# EAGLE design AudioMega 1206 v1 (EAGLE 6.3)
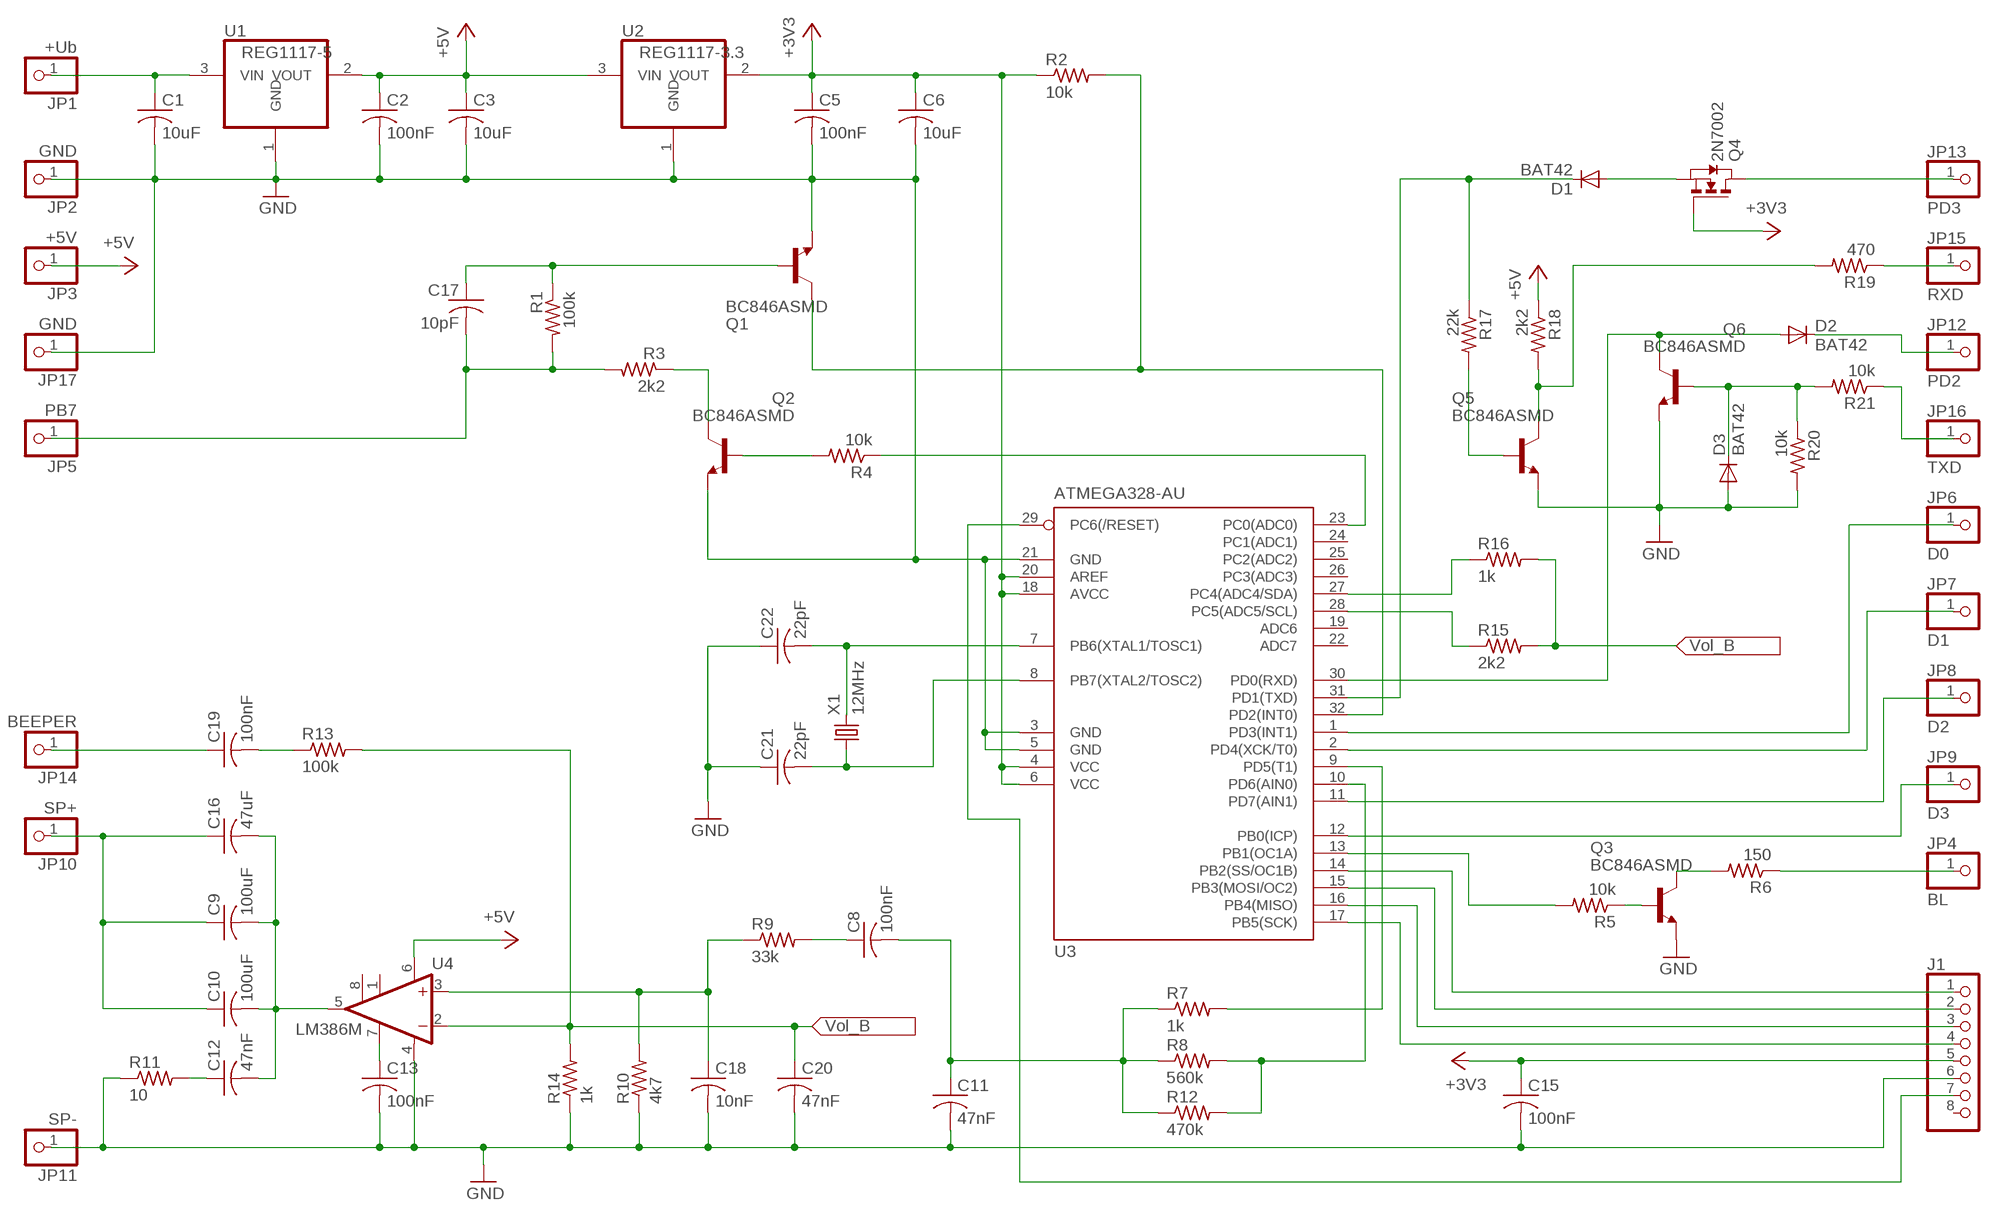
[diagram p0: schematic, sheet 1]

## Parts
C1  10uF  C-USC1206  [C1206]
C2  100nF  C-USC1206  [C1206]
C3  10uF  C-USC1206  [C1206]
C5  100nF  C-USC1206  [C1206]
C6  10uF  C-USC1206  [C1206]
C8  100nF  C-USC1206  [C1206]
C9  100uF  C-USC1206  [C1206]
C10  100uF  C-USC1206  [C1206]
C11  47nF  C-USC1206  [C1206]
C12  47nF  C-USC1206  [C1206]
C13  100nF  C-USC1206  [C1206]
C15  100nF  C-USC1206  [C1206]
C16  47uF  C-USC1206  [C1206]
C17  10pF  C-USC1206  [C1206]
C18  10nF  C-USC1206  [C1206]
C19  100nF  C-USC1206  [C1206]
C20  47nF  C-USC1206  [C1206]
C21  22pF  C-USC1206  [C1206]
C22  22pF  C-USC1206  [C1206]
D1  BAT42  DIODE-SOD123  [SOD123]
D2  BAT42  DIODE-SOD123  [SOD123]
D3  BAT42  DIODE-SOD123  [SOD123]
J1  PINHD-1X8  [1X08]
JP1  +Ub  PINHD-1X1  [1X01]
JP2  GND  PINHD-1X1  [1X01]
JP3  +5V  PINHD-1X1  [1X01]
JP4  BL  PINHD-1X1  [1X01]
JP5  PB7  PINHD-1X1  [1X01]
JP6  D0  PINHD-1X1  [1X01]
JP7  D1  PINHD-1X1  [1X01]
JP8  D2  PINHD-1X1  [1X01]
JP9  D3  PINHD-1X1  [1X01]
JP10  SP+  PINHD-1X1  [1X01]
JP11  SP-  PINHD-1X1  [1X01]
JP12  PD2  PINHD-1X1  [1X01]
JP13  PD3  PINHD-1X1  [1X01]
JP14  BEEPER  PINHD-1X1  [1X01]
JP15  RXD  PINHD-1X1  [1X01]
JP16  TXD  PINHD-1X1  [1X01]
JP17  GND  PINHD-1X1  [1X01]
Q1  BC846ASMD  [SOT23]
Q2  BC846ASMD  [SOT23]
Q3  BC846ASMD  [SOT23]
Q4  2N7002  NMOSSOT23  [SOT-23]
Q5  BC846ASMD  [SOT23]
Q6  BC846ASMD  [SOT23]
R1  100k  R-US_R1206  [R1206]
R2  10k  R-US_R1206  [R1206]
R3  2k2  R-US_R1206  [R1206]
R4  10k  R-US_R1206  [R1206]
R5  10k  R-US_R1206  [R1206]
R6  150  R-US_R1206  [R1206]
R7  1k  R-US_R1206  [R1206]
R8  560k  R-US_R1206  [R1206]
R9  33k  R-US_R1206  [R1206]
R10  4k7  R-US_R1206  [R1206]
R11  10  R-US_R1206  [R1206]
R12  470k  R-US_R1206  [R1206]
R13  100k  R-US_R1206  [R1206]
R14  1k  R-US_R1206  [R1206]
R15  2k2  R-US_R1206  [R1206]
R16  1k  R-US_R1206  [R1206]
R17  22k  R-US_R1206  [R1206]
R18  2k2  R-US_R1206  [R1206]
R19  470  R-US_R1206  [R1206]
R20  10k  R-US_R1206  [R1206]
R21  10k  R-US_R1206  [R1206]
U1  REG1117-5  REG1117  [SOT223]
U2  REG1117-3.3  REG1117  [SOT223]
U3  ATMEGA328-AU  MEGA8-AI  [TQFP32-08]
U4  LM386M  LM386M-1  [SO08]
X1  12MHz  CRYSTALHC49UP  [HC49UP]

## Nets
+3V3: C5.1 C6.1 C15.1 J1.5 Q4.3(G) R2.1 U2.2(VOUT) U3.4(VCC) U3.6(VCC) U3.18(AVCC) U3.20(AREF)
+5V: C2.1 C3.1 JP3.1 R18.1 U1.2(VOUT) U2.3(VIN) U4.6(VS)
B7: C17.2 JP5.1 R1.2 R3.2
CLK: Q1.3(C) R2.2 U3.32(PD2(INT0))
GND: C1.2 C2.2 C3.2 C5.2 C6.2 C11.2 C13.2 C15.2 C18.2 C20.2 C21.1 C22.1 D3.A J1.6 JP2.1 JP11.1 JP17.1 Q1.2(E) Q2.2(E) Q3.2(E) Q5.2(E) Q6.2(E) R10.1 R11.1 R14.1 R20.2 U1.1(GND) U2.1(GND) U3.3(GND) U3.5(GND) U3.21(GND) U4.4(GND)
N$1: R4.1 U3.23(PC0(ADC0))
N$2: J1.1 U3.14(PB2(SS/OC1B))
N$3: J1.2 U3.15(PB3(MOSI/OC2))
N$4: J1.3 U3.16(PB4(MISO))
N$5: J1.4 U3.17(PB5(SCK))
N$6: J1.7 U3.29(PC6(/RESET))
N$7: C22.2 U3.7(PB6(XTAL1/TOSC1)) X1.2
N$8: C21.2 U3.8(PB7(XTAL2/TOSC2)) X1.1
N$9: Q2.1(B) R4.2
N$10: R16.1 U3.27(PC4(ADC4/SDA))
N$11: R15.1 U3.28(PC5(ADC5/SCL))
N$12: Q2.3(C) R3.1
N$13: C17.1 Q1.1(B) R1.1
N$14: C13.1 U4.7(BYPASS)
N$15: C9.1 C10.1 C16.1 JP10.1
N$16: C12.1 R11.2
N$17: C9.2 C10.2 C12.2 C16.2 U4.5(OUT)
N$18: C18.1 R9.1 R10.2 U4.3(+IN)
N$19: C19.1 JP14.1
N$20: C19.2 R13.1
N$24: C8.1 R9.2
N$25: C8.2 C11.1 R7.1 R8.1 R12.1
N$26: Q3.3(C) R6.2
N$27: R7.2 U3.9(PD5(T1))
N$28: R8.2 R12.2 U3.10(PD6(AIN0))
N$29: JP4.1 R6.1
N$30: JP9.1 U3.12(PB0(ICP))
N$31: JP8.1 U3.11(PD7(AIN1))
N$32: C1.1 JP1.1 U1.3(VIN)
N$33: Q3.1(B) R5.1
N$34: R5.2 U3.13(PB1(OC1A))
N$35: JP7.1 U3.2(PD4(XCK/T0))
N$36: JP6.1 U3.1(PD3(INT1))
N$37: JP16.1 R21.1
N$38: JP15.1 R19.1
N$39: D2.C JP12.1
N$40: D3.C Q6.1(B) R20.1 R21.2
N$41: JP13.1 Q4.1(D)
N$42: D2.A Q6.3(C) U3.30(PD0(RXD))
N$43: Q5.3(C) R18.2 R19.2
N$44: Q5.1(B) R17.2
N$45: D1.A Q4.2(S)
N$46: D1.C R17.1 U3.31(PD1(TXD))
VOL_B: C20.1 R13.2 R14.2 R15.2 R16.2 U4.2(-IN)
Unconnected: J1.8 U3.19(ADC6) U3.22(ADC7) U3.24(PC1(ADC1)) U3.25(PC2(ADC2)) U3.26(PC3(ADC3)) U4.1(GAIN) U4.8(GAIN)

## Library data of the parts
C1-C3 C5 C6 C8-C13 C15-C22 = resistor:C-US: CAPACITOR, American symbol
D1-D3 = diode:DIODE-: DIODE
J1 = pinhead:PINHD-1X8: PIN HEADER
JP1-JP17 = pinhead:PINHD-1X1: PIN HEADER
Q1-Q3 Q5 Q6 = transistor-npn:BC846*: NPN Transistor
Q4 = zetex:NMOSSOT23: MOS FET; OC_FARNELL: unknown; OC_NEWARK: unknown
R1-R21 = resistor:R-US_: RESISTOR, American symbol
U1 U2 = burr-brown:REG1117: 800mA and 1A Low Dropout (LDO) Positive Regulator 1.8V, 2.5V, 2.85V, 3.3V, 5V, and Adj; MPN: REG1117; OC_FARNELL: 1097566; OC_NEWARK: 14P6981
U3 = atmel:MEGA8: MICROCONTROLLER 8 Kbytes FLASH, 1 kbytes SRAM, 512 bytes EEPROM, USART, 6-channel 10 bit ADC, 2-channel 8 bit ADC Pin compatible with Atmega48, ATMega88, ATMega168 Source: avr.lbr; MPN: ATMEGA8-16AU; OC_FARNELL: 9171371; OC_NEWARK: 73M8863
U4 = linear:LM386?-*: Low Voltage Audio Power Amplifier Source: http://cache.national.com/ds/LM/LM386.pdf
X1 = crystal:CRYSTAL: CRYSTAL; OC_FARNELL: unknown; OC_NEWARK: unknown

## Board
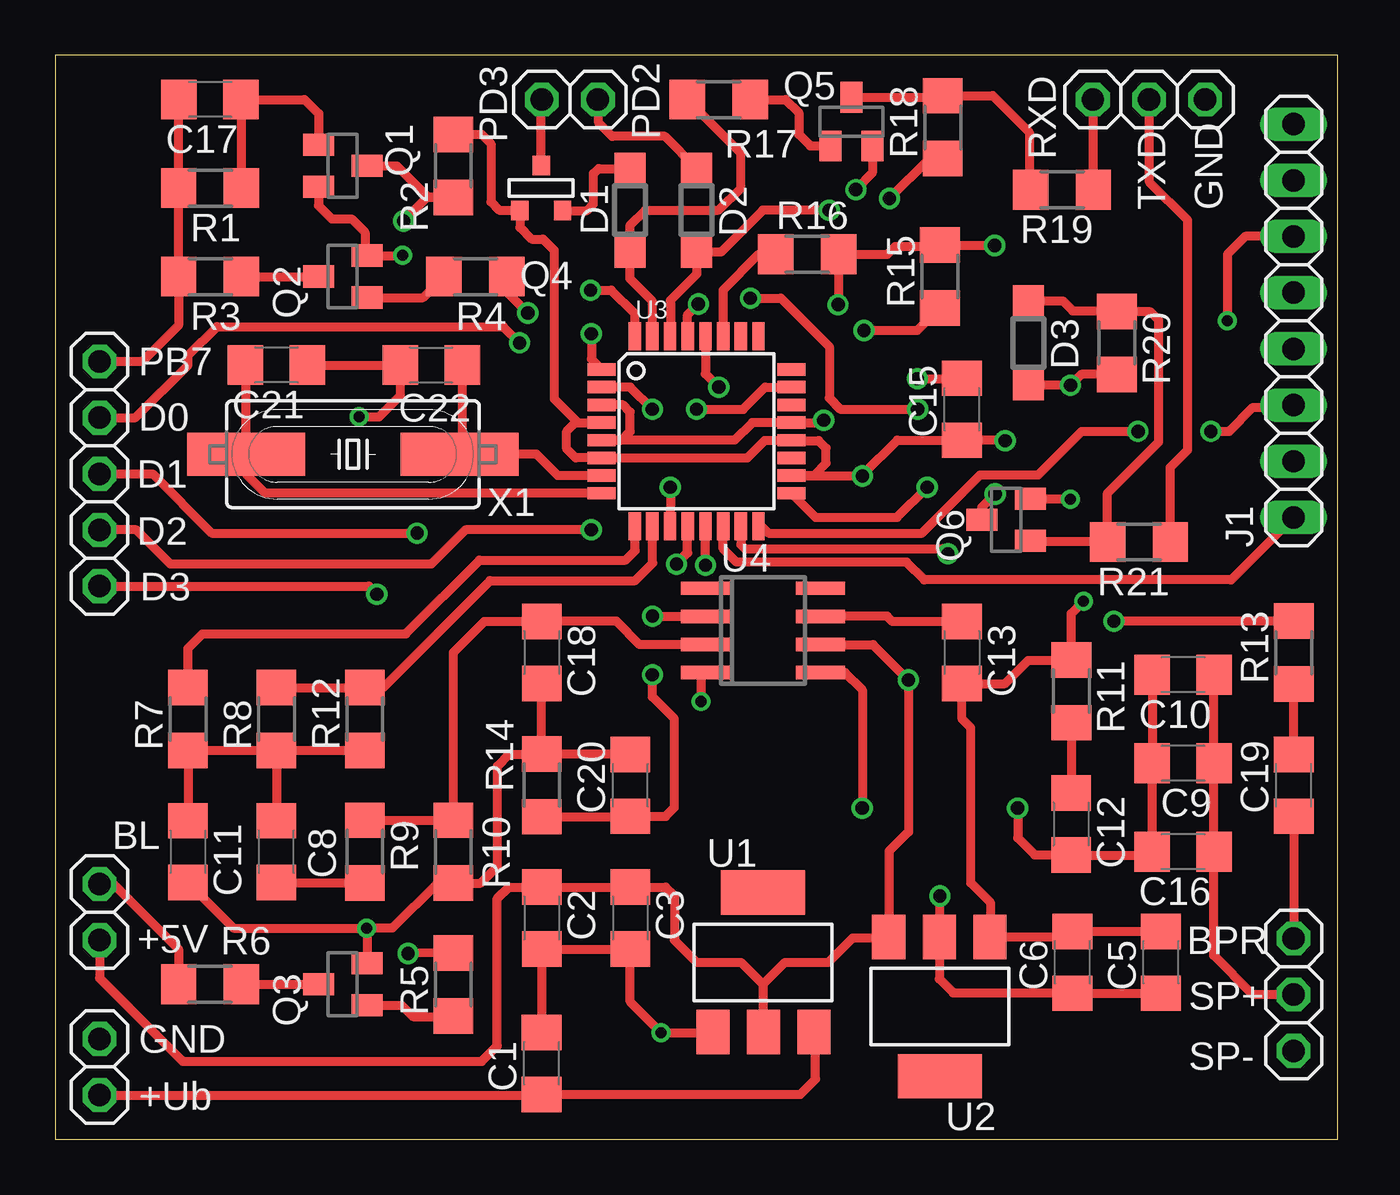
[diagram p1: board, top side]
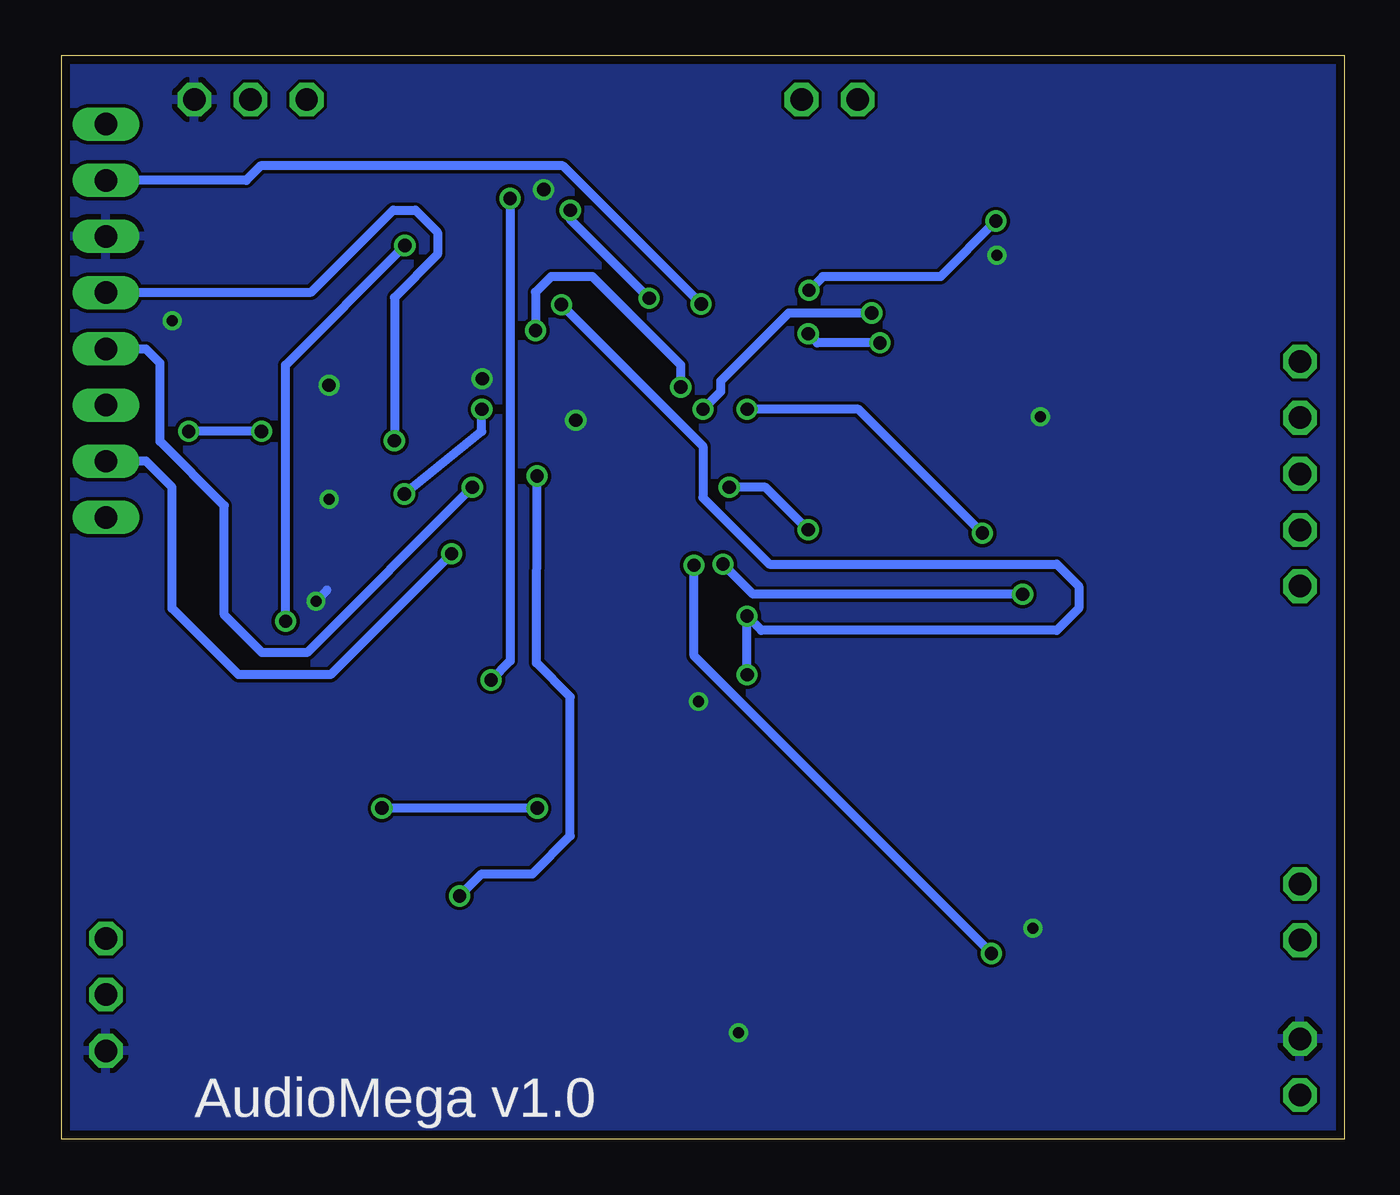
[diagram p2: board, bottom side, seen from below]

Size 58 x 49 mm. Coordinates in mm from the lower left corner, seen from the top.
Outline: 0,0 58,0 58,49 0,49 0,0
Copper layers (1*16): Top 0.0356mm / dielectric 1.5011mm / Bottom 0.0356mm
Design rules "LaenPCBOrder *": minimum track width 6mil, minimum drill 13mil, track to track 6mil, track to pad 6mil, pad to pad 6mil, via to via 6mil, smd to smd 6mil, copper to edge 15mil, drill to drill 6mil, minimum pad ring 7mil, minimum via ring 7mil, stop-mask expansion 4mil, vias tented up to drill 24mil, thermal gap 10mil

### Footprints (pad centres in the part's own frame; a part is rotated, then mirrored left to right if it is on the bottom)
C1206 = smd 1.6 x 1.8: 1 -1.4,0; 2 1.4,0
SOD123 = smd 1.4 x 1.4: A 1.9,0; C -1.9,0
1X08 = drill 1.016 long: 1 -8.89,0; 2 -6.35,0; 3 -3.81,0; 4 -1.27,0; 5 1.27,0; 6 3.81,0; 7 6.35,0; 8 8.89,0
1X01 = drill 1.016 octagon: 1 0,0
SOT23 = smd 1 x 1.4: 1 -0.95,-1.1; 2 0.95,-1.1; 3 0,1.1
SOT-23 = smd 0.787 x 0.889: 1 0.025,-1.016; 2 -0.94,1.016; 3 0.991,1.016
R1206 = smd 1.6 x 1.803: 1 -1.422,0; 2 1.422,0
SOT223 = smd 1.499 x 2.007: 1 -2.261,-3.15; 2 0.025,-3.15; 3 2.311,-3.15 | smd 3.81 x 2.007: 4 0,3.15
TQFP32-08 = smd 1.27 x 0.559: 1 -4.293,2.8; 2 -4.293,2; 3 -4.293,1.2; 4 -4.293,0.4; 5 -4.293,-0.4; 6 -4.293,-1.2; 7 -4.293,-2; 8 -4.293,-2.8; 17 4.293,-2.8; 18 4.293,-2; 19 4.293,-1.2; 20 4.293,-0.4; 21 4.293,0.4; 22 4.293,1.2; 23 4.293,2; 24 4.293,2.8 | smd 0.559 x 1.27: 9 -2.8,-4.293; 10 -2,-4.293; 11 -1.2,-4.293; 12 -0.4,-4.293; 13 0.4,-4.293; 14 1.2,-4.293; 15 2,-4.293; 16 2.8,-4.293; 25 2.8,4.293; 26 2,4.293; 27 1.2,4.293; 28 0.4,4.293; 29 -0.4,4.293; 30 -1.2,4.293; 31 -2,4.293; 32 -2.8,4.293
SO08 = smd 0.6 x 2.2: 1 -1.905,-2.6; 2 -0.635,-2.6; 3 0.635,-2.6; 4 1.905,-2.6; 5 1.905,2.6; 6 0.635,2.6; 7 -0.635,2.6; 8 -1.905,2.6
HC49UP = smd 5.334 x 1.93: 1 -4.826,0; 2 4.826,0

### Placement (x,y rotation side)
C1  21.99,3.43 90 top
C2  22,10 270 top
C3  26,10 270 top
C5  50,8 90 top
C6  46,8 90 top
C8  10,13 90 top
C9  51,17 180 top
C10  51,21 180 top
C11  6,13 270 top
C12  45.94,14.25 270 top
C13  41,22 270 top
C15  41,33 90 top
C16  51,13 180 top
C17  7,47 180 top
C18  22,22 270 top
C19  56,16 90 top
C20  26,16 90 top
C21  10,35 180 top
C22  17,35 0 top
D1  26,42 90 top
D2  29,42 270 top
D3  44,36 270 top
J1  56,37 90 top
JP1  2,2 0 top
JP2  2,4.54 0 top
JP3  2,9 0 top
JP4  2,11.54 0 top
JP5  2,35.16 0 top
JP6  2,32.62 0 top
JP7  2,30.08 0 top
JP8  2,27.54 0 top
JP9  2,25 0 top
JP10  56,6.54 0 top
JP11  56,4 0 top
JP12  24.54,47 0 top
JP13  22,47 0 top
JP14  56,9.08 0 top
JP15  46.92,47 0 top
JP16  49.46,47 0 top
JP17  52,47 0 top
Q1  13,44 270 top
Q2  13,39 90 top
Q3  13,7 90 top
Q4  22,43 180 top
Q5  36,46 0 top
Q6  43,28 90 top
R1  7,43 180 top
R2  18,44 270 top
R3  7,39 180 top
R4  19,39 180 top
R5  18,7 90 top
R6  7,7 0 top
R7  6,19 90 top
R8  10,19 90 top
R9  14,13 270 top
R10  18,13 90 top
R11  45.94,20.25 270 top
R12  14,19 90 top
R13  56,22 90 top
R14  22,16 270 top
R15  40,39 90 top
R16  34,40 0 top
R17  30,47 0 top
R18  40.13,45.75 90 top
R19  45.52,42.93 180 top
R20  48,36 270 top
R21  49,27 180 top
U1  32,8 0 top
U2  40,6 180 top
U3  29,32 0 top
U4  32,23 270 top
X1  13.46,30.97 0 top

### Tracks (layer width: path | path; a pad name or v marks a point on that pad's centre or on a via)
+3V3  (via drill 0.6)
  Top 0.406: C5.1 C6.1 45.98,6.62 40.61,6.62 39.98,7.25 U2.2 40,9.18 v40,11 | 23.65,32.38 23.5,32.38 23.12,32 23.12,31.21 23.53,30.8 U3.6 31.3,30.8 32.08,31.58 33.27,31.58 | 23.65,32.38 24.69,32.38 U3.4 | 33.27,31.58 U3.20 | R2.1 19.28,45.42 19.7,45 19.7,42.37 20.07,42 20.99,42 Q4.3 21.01,41.22 21.54,40.69 22.05,40.69 22.56,40.18 22.56,33.47 23.65,32.38 | v42.95,31.58 42.93,31.6 C15.1 38.08,31.61 36.53,30.06 v36.5,29.98 33.31,29.98 U3.18 33.31,30.02 34.32,30.02 34.86,30.56 34.86,31.24 34.52,31.58 33.27,31.58
  Bottom 0.406: v40,11 39,12 36.71,12 35,13.71 35,20 36.53,21.53 v36.5,29.98 | v42.95,31.58 42.95,38.05 41,40 41,41 42,42 43,42 46.71,38.29 55.98,38.29 J1.5
+5V  (via drill 0.6)
  Top 0.406: 32,7 31,8 29,8 28,9 28,11 27.6,11.4 C3.1 C2.1 20.49,11.4 19.98,10.89 19.98,4.22 19.28,3.52 5.77,3.52 2,7.29 JP3.1 | 32,7 32,4.88 U1.2 | 32,7 33,8 34.96,8 36.06,9.1 37.64,9.1 U2.3 37.7,13.02 38.58,13.9 v38.58,20.76 | U4.6 36.98,22.36 v38.58,20.76 | v38.58,20.76 38.6,20.74 | R18.1 39.52,44.33 v37.72,42.53
  Bottom 0.406: v37.72,42.53 37.72,21.62 v38.58,20.76
B7
  Top 0.406: JP5.1 3.94,35.15 5.58,36.79 R3.2 R1.2 5.58,46.98 C17.2
CLK  (via drill 0.6)
  Top 0.406: Q1.3 15.44,44 16.86,42.58 R2.2 16.82,42.58 v15.75,41.51 | v24.2,38.38 25.14,38.38 26.19,37.33 26.19,36.3 U3.32
  Bottom 0.406: v15.75,41.51 18.26,39 23.58,39 v24.2,38.38
GND  (via drill 0.5, 0.6)
  Top 0.406: J1.6 53.81,40.81 53,40 v53,37 | R14.1 C18.2 | R14.1 25.98,17.42 C20.2 | C1.2 C2.2 C3.2 26,6.22 v27.4,4.82 29.71,4.82 U1.1 | R14.1 21.98,17.4 20.53,17.4 20,16.87 20,12.34 19.24,11.58 R10.1 17.28,11.58 15.24,9.54 v14.07,9.54 | v14.07,9.54 14.1,9.51 Q3.2 | C11.2 8.06,9.54 v14.07,9.54 | C5.2 C6.2 45.75,9.15 U2.1 42.28,9.17 42.28,10.71 41.4,11.59 41.4,18.6 41,19 C13.2 42.95,20.6 44,21.65 45.92,21.65 R11.1 45.94,23.76 v46.5,24.32 | C21.1 C22.1 15.6,33.61 14.63,32.64 13.76,32.64 v13.73,32.67 | Q1.2 11.9,42.21 12.5,41.61 13.39,41.61 14,41 14,40.05 Q2.2 15.69,39.95 v15.71,39.97 | U4.4 29.2,20.89 v29.2,19.79 | U3.3 25.67,33.2 26,32.87 26,32 25.6,31.6 U3.5 30.72,31.6 31.52,32.4 U3.21 34.65,32.4 v34.75,32.5 | Q5.2 36.95,43.68 v36.2,42.93 | 38.96,34.4 v38.98,34.38 40.98,34.38 C15.2 | D3.A v45.9,34.1 v45.91,34.09 46.4,34.58 R20.2 | Q6.2 45.88,28.95 v45.9,28.93
  Bottom 0.406: v46.5,24.32 46,24.82
  pour Bottom: 0,49 58,49 58,0 0,0
N$1  (via drill 0.6)
  Top 0.406: R4.1 20.42,38.3 v21.37,37.35 | v29,33 31.1,33 32.1,34 U3.23
  Bottom 0.406: v21.37,37.35 25.12,37.35 28.2,34.27 28.2,33.8 v29,33
N$2
  Top 0.406: J1.1 53.18,25.29 39.3,25.29 38.5,26.09 30.81,26.09 30.2,26.7 U3.14
N$3  (via drill 0.6)
  Top 0.406: U3.15 31,26.88 31.18,26.7 40.14,26.7 v40.37,26.47
  Bottom 0.406: v40.37,26.47 45.84,21 50,21 53,24 53,29.47 54.18,30.65 J1.2
N$4  (via drill 0.6)
  Top 0.406: U3.16 31.87,27.78 32.25,27.4 39.2,27.4 41.83,30.03 44.45,30.03 46.42,32 v48.96,32 | v52.25,32 53.08,32 54.16,33.08 55.89,33.08 J1.3
  Bottom 0.406: v48.96,32 v52.25,32
N$5  (via drill 0.6)
  Top 0.406: U3.17 34.38,28.11 38.07,28.11 v39.43,29.47
  Bottom 0.406: v39.43,29.47 46.9,22 48.94,22 50.64,23.7 50.64,28.64 53.55,31.55 53.55,35.09 54.18,35.72 J1.4
N$6  (via drill 0.6)
  Top 0.406: U3.29 28.6,37.28 v29.08,37.76
  Bottom 0.406: v29.08,37.76 v29.09,37.76 35.33,44 49,44 49.65,43.35 J1.7
N$7
  Top 0.406: C22.2 18.4,31.08 X1.2 21.76,30.97 22.73,30 U3.7
N$8
  Top 0.406: C21.2 8.6,31 X1.1 8.63,30.07 9.47,29.23 24.68,29.23 U3.8
N$9
  Top 0.406: Q2.1 16.63,38.05 R4.2
N$10
  Top 0.406: R16.1 31.81,40 30.2,38.39 U3.27
N$11  (via drill 0.6)
  Top 0.406: U3.28 29.4,34.6 v30,34 | v36.57,36.56 38.98,36.56 R15.1
  Bottom 0.406: v30,34 30,35 34,39 35.86,39 36.57,38.29 v36.57,36.56
N$12
  Top 0.406: R3.1 Q2.3
N$13
  Top 0.406: R1.1 8.4,43.02 C17.1 11.27,47 11.91,46.36 Q1.1
N$14
  Top 0.406: C13.1 37.86,23.4 37.61,23.65 34.62,23.65 U4.7
N$15
  Top 0.406: JP10.1 54.15,6.54 52.38,8.31 52.38,12.98 C16.1 C9.1 C10.1
N$16
  Top 0.406: R11.2 C12.1
N$17  (via drill 0.6)
  Top 0.406: C10.2 C9.2 C16.2 49.45,12.85 C12.2 44.29,12.86 43.52,13.63 v43.52,14.97 | U4.5 35.72,21.09 36.49,20.32 v36.49,14.97
  Bottom 0.406: v36.49,14.97 v43.52,14.97
N$18
  Top 0.406: R9.1 R10.2 18,22 19.4,23.4 C18.1 22.02,23.42 25.37,23.42 26.43,22.36 U4.3
N$19
  Top 0.406: C19.1 JP14.1
N$20
  Top 0.406: C19.2 R13.1
N$24
  Top 0.406: C8.1 13.98,11.6 R9.2
N$25
  Top 0.406: R8.1 R12.1 | R8.1 R7.1 C11.1 | R8.1 C8.2
N$26
  Top 0.406: R6.2 Q3.3
N$27
  Top 0.406: R7.2 6,22.19 6.66,22.85 15.85,22.85 19.18,26.18 25.79,26.18 26.22,26.61 26.22,27.69 U3.9
N$28
  Top 0.406: R8.2 R12.2 14.83,20.42 19.66,25.25 26.22,25.25 27.01,26.04 27.01,27.7 U3.10
N$29
  Top 0.406: JP4.1 2.63,11.54 5.58,8.59 R6.1
N$30  (via drill 0.6)
  Top 0.406: JP9.1 14.18,25 v14.54,24.64 | v28.09,26 28.6,26.51 U3.12
  Bottom 0.406: v14.54,24.64 26.73,24.64 v28.09,26
N$31  (via drill 0.6)
  Top 0.406: v27.81,29.47 U3.11 | v24.24,27.55 18.55,27.55 17,26 5.21,26 3.66,27.55 JP8.1
  Bottom 0.406: v24.24,27.55 26.16,29.47 v27.81,29.47
N$32
  Top 0.406: JP1.1 21.96,2 C1.1 33.69,2.03 34.38,2.72 34.38,4.78 U1.3
N$33
  Top 0.406: Q3.1 15.67,6.05 16.18,5.54 17.96,5.54 R5.1
N$34  (via drill 0.6)
  Top 0.406: R5.2 v15.95,8.4 | v29.4,25.95 U3.13
  Bottom 0.406: v15.95,8.4 29.4,21.85 v29.4,25.95
N$35  (via drill 0.6)
  Top 0.406: JP7.1 4.4,30.08 7.08,27.4 v16.36,27.4 | v27,33 26,34 U3.2
  Bottom 0.406: v16.36,27.4 21.96,33 v27,33
N$36  (via drill 0.6)
  Top 0.406: JP6.1 3.62,32.62 6,35 6,35.43 7.31,36.74 20.26,36.74 v21,36 | v24.24,36.41 24.24,35.27 U3.1
  Bottom 0.406: v21,36 23.83,36 v24.24,36.41
N$37
  Top 0.406: R21.1 50.42,30.37 51.21,31.16 51.21,41.54 49.48,43.27 49.48,46.98 JP16.1
N$38
  Top 0.406: R19.1 46.94,46.98 JP15.1
N$39
  Top 0.406: D2.C 27.57,45.33 25.18,45.33 24.57,45.94 24.57,46.97 JP12.1
N$40
  Top 0.406: D3.C 45.56,37.9 46.01,37.45 47.97,37.45 R20.1 48.02,37.4 49.52,37.4 49.9,37.02 49.9,31.53 47.58,29.21 R21.2 44.15,27 Q6.1
N$41
  Top 0.406: Q4.1 21.98,46.98 JP13.1
N$42  (via drill 0.6)
  Top 0.406: U3.30 27.81,36.3 27.81,37.92 29,39.11 D2.A 30.1,40.1 32,42 v35,42 | 42,28.1 Q6.3 41.9,28.57 v42.5,29.17 | 38.96,32.96 v39,33 v38.99,33.01 35.49,33.01 35,33.5 35,35.83 32.81,38.02 v31.43,38.02
  Bottom 0.406: v31.43,38.02 35,41.59 v35,42 | v42.5,29.17 39,32 v39,33
N$43
  Top 0.406: Q5.3 40.06,47.1 R18.2 42.39,47.17 44.04,45.52 44.04,42.99 R19.2
N$44
  Top 0.406: R17.2 33.03,47 33.62,46.41 33.62,45.43 34.14,44.91 Q5.1
N$45
  Top 0.406: Q4.2 24.04,41.98 24.34,42.28 24.34,43.65 24.57,43.88 25.98,43.88 D1.A
N$46
  Top 0.406: U3.31 27,37.88 25.98,38.9 25.98,40.08 D1.C 26,41.32 26.68,42 30,42 31,43 31,44.58 R17.1
VOL_B  (via drill 0.6)
  Top 0.406: R14.2 25.98,14.58 C20.1 27.6,14.6 28,15 28,19 27,20 v27,21 | v27.01,23.65 27.02,23.64 U4.2 | v35.4,37.73 35.42,37.75 R16.2 37.63,40 37.99,40.36 39.94,40.36 R15.2 40.02,40.4 v42.48,40.4 | R13.2 48.39,23.42 v47.87,23.42
  Bottom 0.406: v27,21 v27.01,21.01 v27.01,23.65 26.36,23 13,23 12,24 12,25 13,26 26,26 29,29 29,31.33 v35.4,37.73 | v47.87,23.42 47.87,35 v42.48,40.4

### Text on the board
tNames: PD3 | PD2 | RXD | TXD | GND | PB7 | D0 | D1 | D2 | D3 | BL | +5V | BPR | SP+ | GND | SP- | +Ub
bNames: AudioMega v1.0